# EAGLE schematic BusPirate-v3.8-SSOP (EAGLE 5.07)
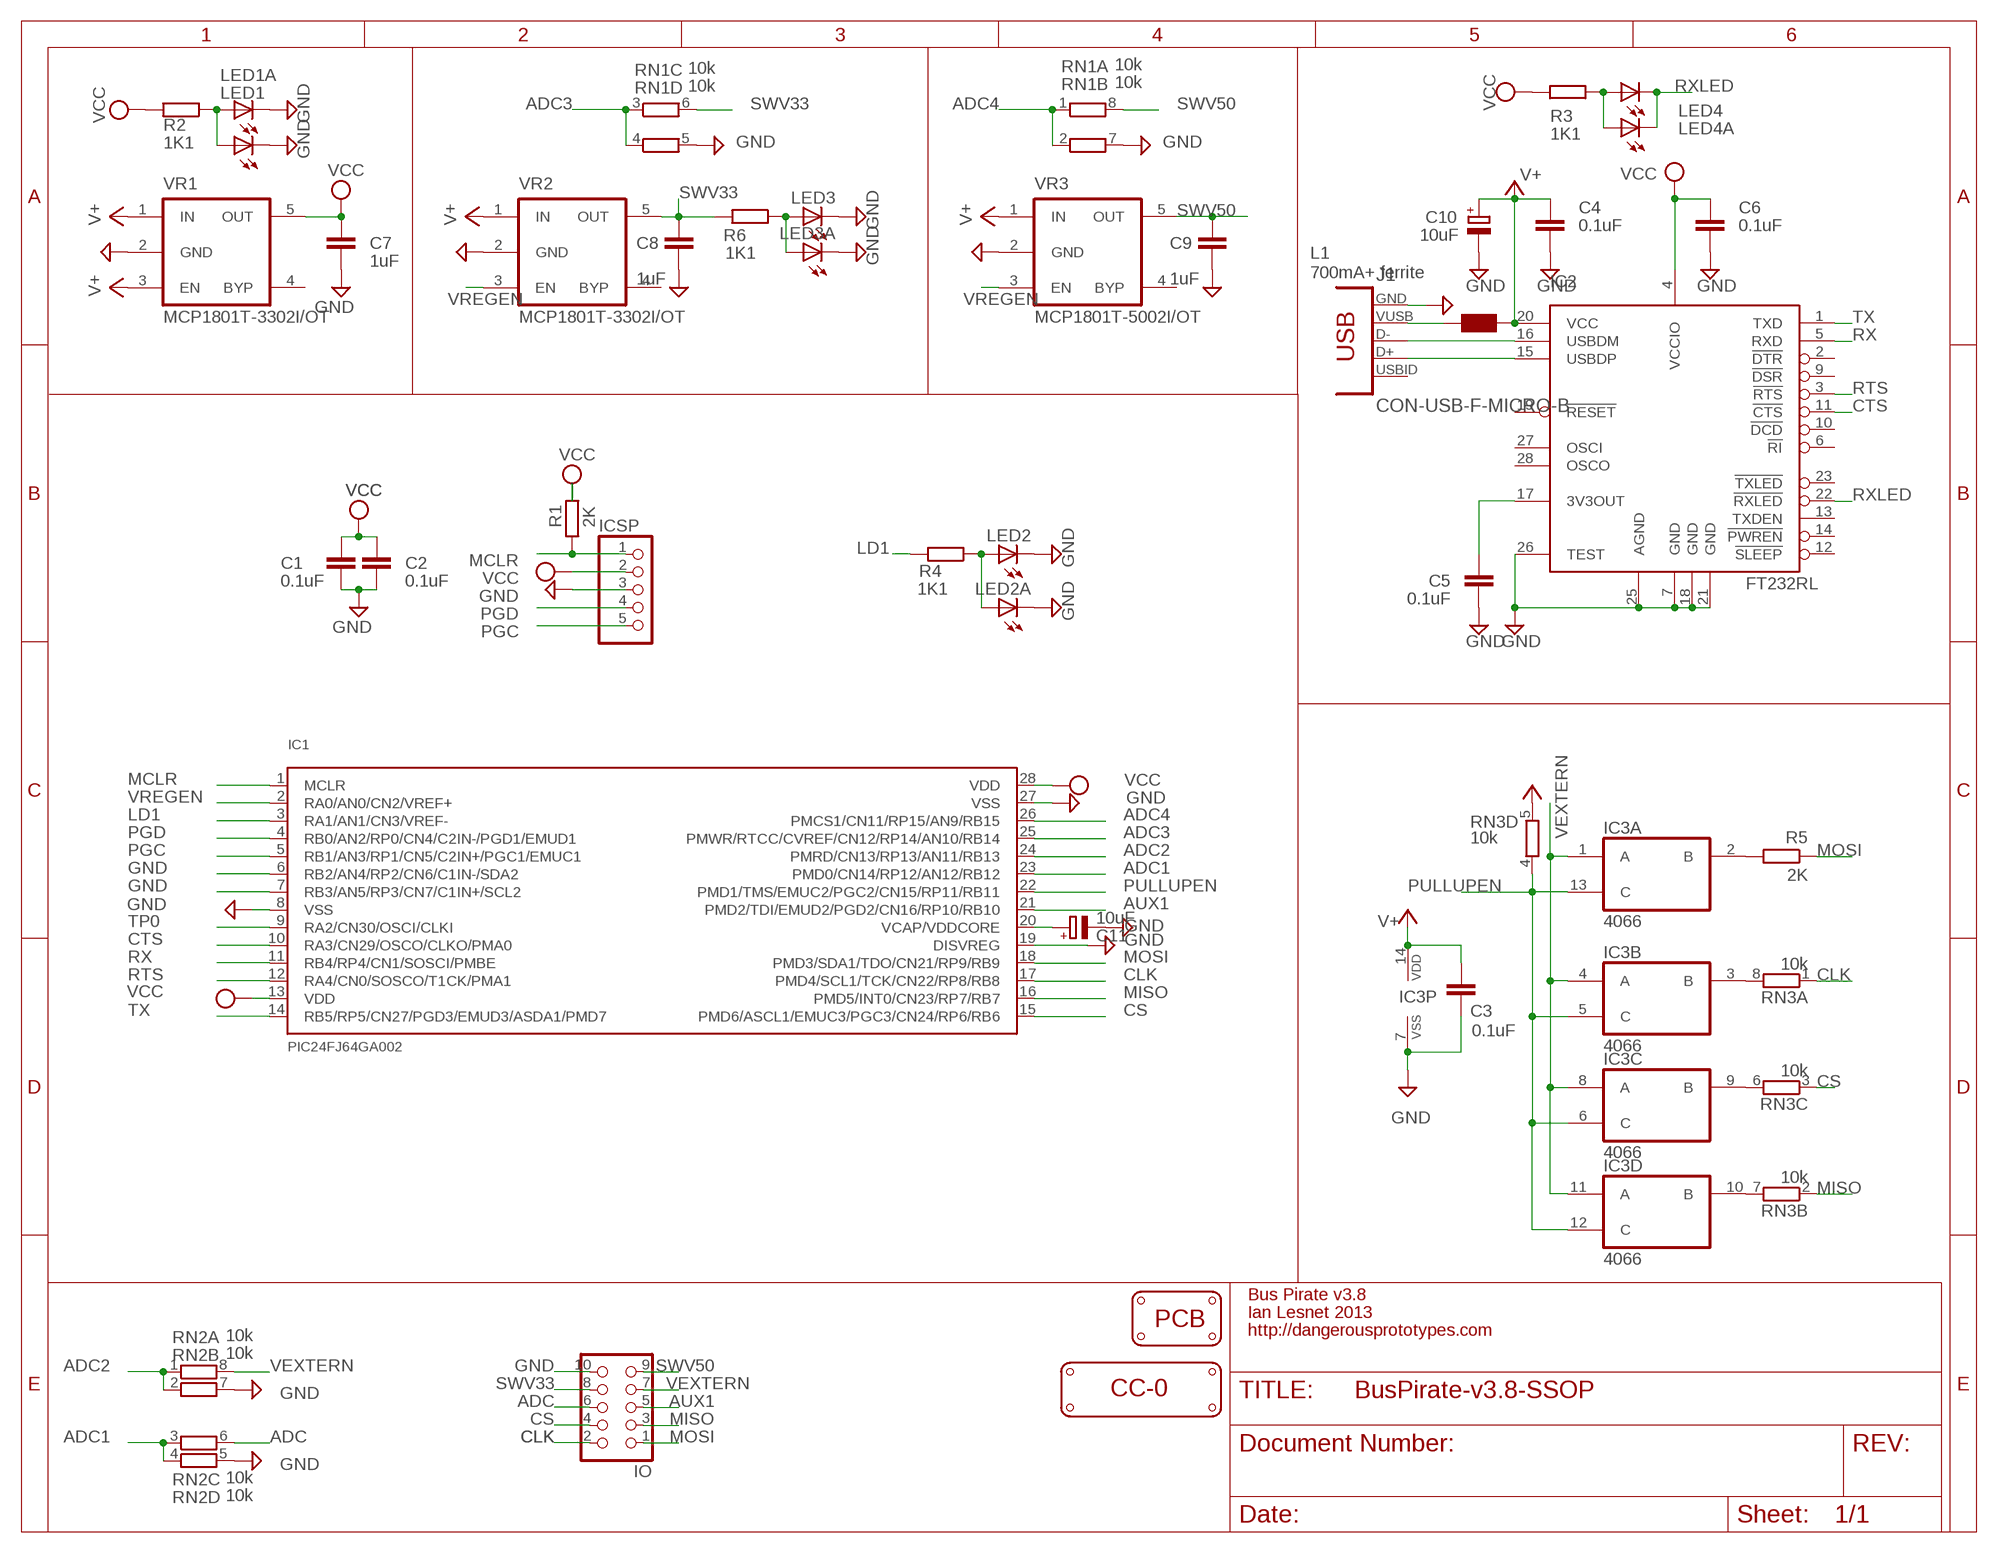
[diagram p0: schematic, sheet 1]

## Parts
C1  0.1uF  CAPC603  [C603]
C2  0.1uF  CAPC603  [C603]
C3  0.1uF  CAPC603  [C603]
C4  0.1uF  CAPC603  [C603]
C5  0.1uF  CAPC603  [C603]
C6  0.1uF  CAPC603  [C603]
C7  1uF  CAPC603  [C603]
C8  1uF  CAPC603  [C603]
C9  1uF  CAPC603  [C603]
C10  10uF  CPOL-EUSMCA  [SMC_A]
C11  10uF  CPOL-EUSMCA  [SMC_A]
IC1  PIC24FJ64GA002  [SSOP28]
IC2  FT232RL  [SSOP28]
IC3  4066  [TSSOP14]
ICSP  PINHD-1X5  [1X05]
IO  CON_HEADER_2X05-PTH+SHROUDED_A  [PINSHRD_PTH_2X05]
J1  CON-USB-F-MICRO-B  [CONN_USB_MICRO-B]
L1  700mA+ ferrite  WE-KIL_0805  [WE-KI_0805_B]
LED1  LED-0603  [LED-603]
LED1A  LED-0603  [LED-603]
LED2  LED-0603  [LED-603]
LED2A  LED-0603  [LED-603]
LED3  LED-0603  [LED-603]
LED3A  LED-0603  [LED-603]
LED4  LED-0603  [LED-603]
LED4A  LED-0603  [LED-603]
LOGO1  LOGO_CC-0  [LOGO_CC-0]
PCB1  PCB_DP_RECTANGLE-37X60  [DP6037_V1]
R1  2K  RESISTORR603  [R603]
R2  1K1  RESISTORR603  [R603]
R3  1K1  RESISTORR603  [R603]
R4  1K1  RESISTORR603  [R603]
R5  2K  RESISTORR603  [R603]
R6  1K1  RESISTORR603  [R603]
RN1  10k  RNETWORK  [RN8P-4R-CRA06S]
RN2  10k  RNETWORK  [RN8P-4R-CRA06S]
RN3  10k  RNETWORK  [RN8P-4R-CRA06S]
VR1  MCP1801T-3302I/OT  MIC5205  [SOT-23-5]
VR2  MCP1801T-3302I/OT  MIC5205  [SOT-23-5]
VR3  MCP1801T-5002I/OT  MIC5205  [SOT-23-5]

## Nets
$N26: J1.P1(VUSB) L1.2
ADC: IO.6 RN2.6
ADC1: IC1.23(PMD0/CN14/RP12/AN12/RB12) RN2.3 RN2.4
ADC2: IC1.24(PMRD/CN13/RP13/AN11/RB13) RN2.1 RN2.2
ADC3: IC1.25(PMWR/RTCC/CVREF/CN12/RP14/AN10/RB14) RN1.3 RN1.4
ADC4: IC1.26(PMCS1/CN11/RP15/AN9/RB15) RN1.1 RN1.2
AUX1: IC1.21(PMD2/TDI/EMUD2/PGD2/CN16/RP10/RB10) IO.5
CLK: IC1.17(PMD4/SCL1/TCK/CN22/RP8/RB8) IO.2 RN3.1
CS: IC1.15(PMD6/ASCL1/EMUC3/PGC3/CN24/RP6/RB6) IO.4 RN3.3
CTS: IC1.10(RA3/CN29/OSCO/CLKO/PMA0) IC2.11(!CTS)
GND: C1.2 C2.2 C3.2 C4.2 C5.2 C6.2 C7.2 C8.2 C9.2 C10.- C11.- IC1.6(RB2/AN4/RP2/CN6/C1IN-/SDA2) IC1.7(RB3/AN5/RP3/CN7/C1IN+/SCL2) IC1.8(VSS) IC1.19(DISVREG) IC1.27(VSS) IC2.7(GND) IC2.18(GND) IC2.21(GND) IC2.25(AGND) IC2.26(TEST) IC3.7(P:VSS) ICSP.3 IO.10 J1.P5(GND) LED1.C LED1A.C LED2.C LED2A.C LED3.C LED3A.C RN1.5 RN1.7 RN2.5 RN2.7 VR1.2(GND) VR2.2(GND) VR3.2(GND)
LD1: IC1.3(RA1/AN1/CN3/VREF-) R4.2
MCLR: IC1.1(MCLR) ICSP.1 R1.1
MISO: IC1.16(PMD5/INT0/CN23/RP7/RB7) IO.3 RN3.2
MOSI: IC1.18(PMD3/SDA1/TDO/CN21/RP9/RB9) IO.1 R5.1
N$1: IC3.2(A:B) R5.2
N$2: IC3.9(C:B) RN3.6
N$3: C11.+ IC1.20(VCAP/VDDCORE)
N$4: IC3.10(D:B) RN3.7
N$5: IC3.3(B:B) RN3.8
N$6: LED2.A LED2A.A R4.1
N$7: LED1.A LED1A.A R2.1
N$9: C5.1 IC2.17(3V3OUT)
N$13: LED4.A LED4A.A R3.1
N$15: IC2.15(USBDP) J1.P3(D+)
N$16: IC2.16(USBDM) J1.P2(D-)
N$18: LED3.A LED3A.A R6.1
PGC: IC1.5(RB1/AN3/RP1/CN5/C2IN+/PGC1/EMUC1) ICSP.5
PGD: IC1.4(RB0/AN2/RP0/CN4/C2IN-/PGD1/EMUD1) ICSP.4
PULLUPEN: IC1.22(PMD1/TMS/EMUC2/PGC2/CN15/RP11/RB11) IC3.5(B:C) IC3.6(C:C) IC3.12(D:C) IC3.13(A:C) RN3.4
RTS: IC1.12(RA4/CN0/SOSCO/T1CK/PMA1) IC2.3(!RTS)
RX: IC1.11(RB4/RP4/CN1/SOSCI/PMBE) IC2.5(RXD)
RXLED: IC2.22(!RXLED) LED4.C LED4A.C
SWV33: C8.1 IO.8 R6.2 RN1.6 VR2.5(OUT)
SWV50: C9.1 IO.9 RN1.8 VR3.5(OUT)
TP0: IC1.9(RA2/CN30/OSCI/CLKI)
TX: IC1.14(RB5/RP5/CN27/PGD3/EMUD3/ASDA1/PMD7) IC2.1(TXD)
V+: C3.1 C4.1 C10.+ IC2.20(VCC) IC3.14(P:VDD) L1.1 RN3.5 VR1.1(IN) VR1.3(EN) VR2.1(IN) VR3.1(IN)
VCC: C1.1 C2.1 C6.1 C7.1 IC1.13(VDD) IC1.28(VDD) IC2.4(VCCIO) ICSP.2 R1.2 R2.2 R3.2 VR1.5(OUT)
VEXTERN: IC3.1(A:A) IC3.4(B:A) IC3.8(C:A) IC3.11(D:A) IO.7 RN2.8
VREGEN: IC1.2(RA0/AN0/CN2/VREF+) VR2.3(EN) VR3.3(EN)
Unconnected: IC2.2(!DTR) IC2.6(!RI) IC2.9(!DSR) IC2.10(!DCD) IC2.12(!SLEEP) IC2.13(TXDEN) IC2.14(!PWREN) IC2.19(!RESET) IC2.23(!TXLED) IC2.27(OSCI) IC2.28(OSCO) J1.BODY@1(BODY) J1.BODY@2(BODY) J1.BODY@3(BODY) J1.BODY@4(BODY) J1.P4(USBID) VR1.4(BYP) VR2.4(BYP) VR3.4(BYP)

## Notes on the sheet
- Bus Pirate v3.8
- Ian Lesnet 2013
- http://dangerousprototypes.com

## Library data of the parts
C1-C9 = dp_devices:CAP
C10 C11 = rcl:CPOL-EU: POLARIZED CAPACITOR, European symbol
IC1 = dp_devices:PIC24FJ64GA002: 16-bit General Purpose Flash Microcontroller
IC2 = dp_devices:FT232RL: USB to serial UART interface
IC3 = 40xx:4066: Quad bilateral ANALOG SWITCH
ICSP = pinhead:PINHD-1X5: PIN HEADER
IO = dp_devices:CON_HEADER_2X05: 2x05 pin header
J1 = dp_devices:CON-USB-F: USB Female connector
L1 = wuerth-elektronik:WE-KIL: SMD Wire Wound Ceramic Inductor WE-KIL - Low profile - High Q values -- Bluetooth -- Wireless LAN -- RF oscillation circuit -- IF impedance matching
LED1 LED1A LED2 LED2A LED3 LED3A LED4 LED4A = dp_devices:LED: Light Emitting Diode
LOGO1 = dp_devices:LOGO_CC-0
PCB1 = dp_devices:PCB_DP_RECTANGLE: Dangerous Prototypes Standard Rectangular PCB sizes
R1-R6 = dp_devices:RESISTOR
RN1-RN3 = dp_devices:RNETWORK: 4 Resistor Array 0603
VR1-VR3 = dp_devices:MIC5205: 150ma Low-Noise LDO Regulator